# Altium schematic sheet ADP526X.SchDoc
size A3
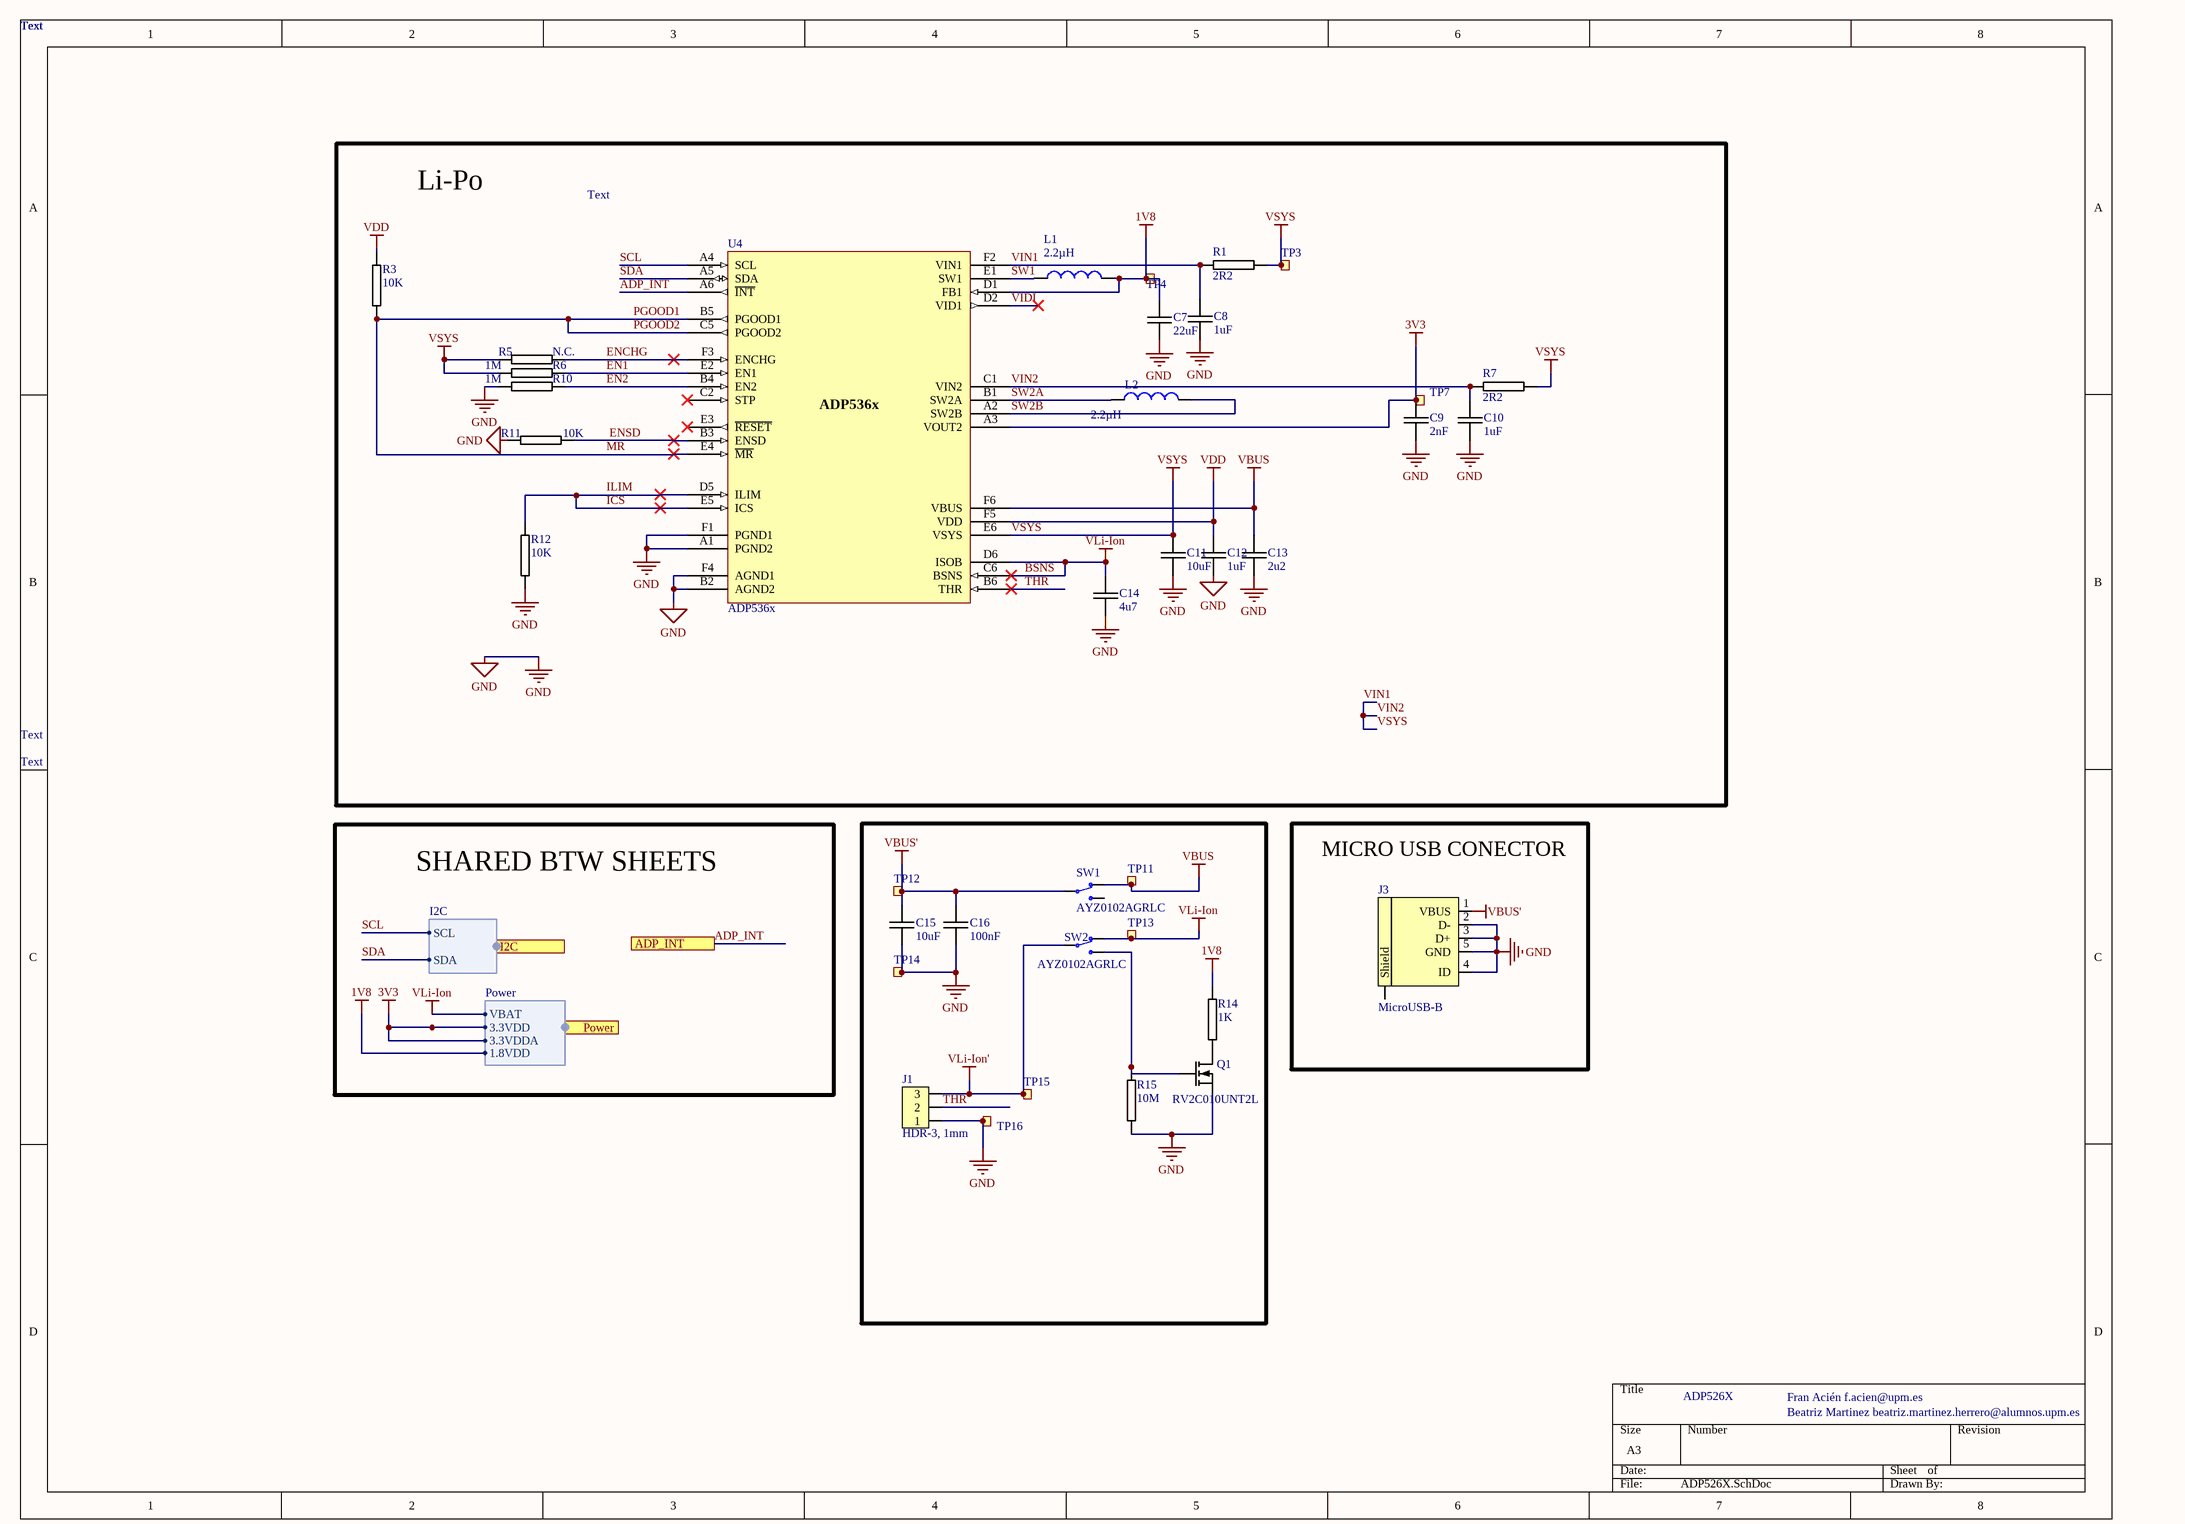
[diagram p0: ADP526X.SchDoc]

## Parts
C7  22uF  [0402C-TBD]
C8  1uF  [0402C-GENERIC]
C9  2nF  [0402C-TBD]
C10  1uF  [0402C-GENERIC]
C11  10uF  [0402C-GENERIC]
C12  1uF  [0402C-GENERIC]
C13  2u2  [0402C-GENERIC]
C14  4u7  [0402C-GENERIC]
C15  10uF  [0603C-GENERIC]
C16  100nF  [0603C-GENERIC]
J1  HDR-3, 1mm  [SM03B-SRSS-TB]
J3  MicroUSB-B  [USB-Micro-B-RA-SMD-PiP]
L1  2.2µH  [INDC2016X18N]
L2  2.2µH  [INDC2016X18N]
Q1  RV2C010UNT2L  [DFN65P100X40-3L]
R1  2R2  [0603R-GENERIC]
R3  10K  [0603R-10K]
R5  N.C.  [0603R-GENERIC]
R6  1M  [0603R-GENERIC]
R7  2R2  [0603R-GENERIC]
R10  1M  [0603R-GENERIC]
R11  10K  [0603R-10K]
R12  10K  [0603R-10K]
R14  1K  [0603R-1k]
R15  10M  [0603R-GENERIC]
SW1  AYZ0102AGRLC  [AYZ0102AGRLC]
SW2  AYZ0102AGRLC  [AYZ0102AGRLC]
TP3  Ø1.0mm,SMD  [TP_SMD_Ø1.0mm]  (value not drawn)  (no BOM)
TP4  Ø1.0mm,SMD  [TP_SMD_Ø1.0mm]  (value not drawn)  (no BOM)
TP7  Ø1.0mm,SMD  [TP_SMD_Ø1.0mm]  (value not drawn)  (no BOM)
TP11  Ø1.0mm,SMD  [TP_SMD_Ø1.0mm]  (value not drawn)  (no BOM)
TP12  Ø1.0mm,SMD  [TP_SMD_Ø1.0mm]  (value not drawn)  (no BOM)
TP13  Ø1.0mm,SMD  [TP_SMD_Ø1.0mm]  (value not drawn)  (no BOM)
TP14  Ø1.0mm,SMD  [TP_SMD_Ø1.0mm]  (value not drawn)  (no BOM)
TP15  Ø1.0mm,SMD  [TP_SMD_Ø1.0mm]  (value not drawn)  (no BOM)
TP16  Ø1.0mm,SMD  [TP_SMD_Ø1.0mm]  (value not drawn)  (no BOM)
U4  ADP536x  [BGA32C40P6X6_238X238X56]

## Blocks framed on the sheet
Li-Po: C7-C14 L1 L2 R1 R3 R5-R7 R10-R12 TP3 TP4 TP7 U4
MICRO USB CONECTOR: J3

## Ports
ADP_INT, I2C (harness I2C), Power (harness Power)

## Harnesses
I2C: SCL, SDA
Power: VBAT, 3.3VDD, 3.3VDDA, 1.8VDD

## Nets
1V8: C7.1 L1.2 R14.1 TP4.1 U4.D1(FB1) ; port Power.1.8VDD
3V3: C9.1 TP7.1 U4.A3(VOUT2) ; port Power.3.3VDD, port Power.3.3VDDA
BSNS: C14.1 SW2.1(N.C) TP13.1 U4.C6(BSNS) U4.D6(ISOB) ; port Power.VBAT  [also labelled VLi-Ion]
GND: C7.2 C8.2 C9.2 C10.2 C11.2 C12.2 C13.2 C14.2 C15.2 C16.2 J1.1 J3.2(D-) J3.3(D+) J3.4(ID) J3.5(GND) Q1.2(S) R10.1 R11.2 R12.2 R15.2 TP14.1 TP16.1 U4.A1(PGND2) U4.B2(AGND2) U4.F1(PGND1) U4.F4(AGND1)
VBUS: C13.1 SW1.1(N.C) TP11.1 U4.F6(VBUS)
VBUS': C15.1 C16.1 J3.1(VBUS) SW1.2(COM) TP12.1
VDD: C12.1 R3.2 U4.F5(VDD)
VIN1: C8.1 C10.1 C11.1 R1.1 R1.2 R5.1 R6.1 R7.1 R7.2 TP3.1 U4.C1(VIN2) U4.E6(VSYS) U4.F2(VIN1)  [also labelled VIN2, VSYS]
VLi-Ion': J1.3 SW2.2(COM) TP15.1
ADP_INT: U4.A6(~{INT}) ; port ADP_INT
EN1: R6.2 U4.E2(EN1)
EN2: R10.2 U4.B4(EN2)
ENCHG: R5.2 U4.F3(ENCHG)
ENSD: R11.1 U4.B3(ENSD)
ICS: R12.1 U4.D5(ILIM) U4.E5(ICS)
PGOOD1: R3.1 U4.B5(PGOOD1) U4.C5(PGOOD2) U4.E4(~{MR})  [also labelled PGOOD2]
SCL: U4.A4(SCL) ; port I2C.SCL
SDA: U4.A5(SDA) ; port I2C.SDA
SW1: L1.1 U4.E1(SW1)
SW2A: L2.1 U4.B1(SW2A)
SW2B: L2.2 U4.A2(SW2B)
THR: J1.2 U4.B6(THR)
VIDI: U4.D2(VID1)
NetQ1_1: Q1.1(G) R15.1 SW2.3(N.O)
NetQ1_3: Q1.3(D) R14.2

Not connected (* = marked no-connect by the designer): J3 6(Shield); SW1 3(N.O); U4 C2(STP)* E3(~{RESET})*

## Notes on the sheet
- Text
- SHARED BTW SHEETS
- ADP526X
- Fran Acién f.acien@upm.es
- Beatriz Martinez beatriz.martinez.herrero@alumnos.upm.es
- Labels drawn without touching a wire or pin: ILIM, MR

## Library data of the parts
C7-C11 C14 = 0402C-10UF-4V-X5R-SAM: CAPACITOR 0402 CERAMIC; Reel: C47
C12 = 0402C-1UF-25V-X5R-SAM: CAPACITOR 0402 CERAMIC; Reel: C49
C13 = 0402C-2U2-10V-X5R-SAM: CAPACITOR 0402 CERAMIC; Reel: C16
C15 = 0603C-10UF-10V-X5R-TDK: CAPACITOR 0603 CERAMIC; Manufacturer Part Number: C1608X5R0J106M; Manufacturer: TDK Corporation; Reel: C31; Supplier 1: Digi-Key; Supplier Part Number 1: 445-4112-2-ND
C16 = 0603C-100NF-25V-X7R-TDK: CAPACITOR 0603 CERAMIC; Manufacturer Part Number: C1608X7R1E104K; Manufacturer: TDK Corporation; Reel: C12; Supplier 1: Digi-Key; Supplier Part Number 1: 445-1316-2-ND
J1 = SM03B-SRSS-TB: 1.0mm pitch connector side entry SMD; Manufacturer: JST; Manufacturer Part Number: SM03B-SRSS-TB(LF)(SN); Part number IPS: 00000001785; Note: JST, Header; Artikkelnr Noca: N.A.; Part Number: SM03B-SRSS-TB; Footprint Doc: SM03B-SRSS-TB; LatestRevisionDate: 2017-10-09; Pin Count: 3; Publisher: Nordic Semiconductor; Published: 2017-10-09; Value: HDR-3, 1mm; ComponentLink1URL: *; ComponentLink1Description: Datasheet; ComponentLink2URL: *; ComponentLink2Description: Supplier link; HelpURL: http://www.jst-mfg.com/product/pdf/eng/eSH.pdf; Supplier 1: Digi-Key; Supplier Part Number 1: 455-1803-1-ND; Supplier 2: *; Supplier Part Number 2: *
J3 = MiniUSB-AB-SMT: MicroUSB-B-SMT; Manufacturer: Allen Creations Corp.; Manufacturer Part Number: AJU55-BS2111-L; Part number IPS: 00000007790; Artikkelnr Noca: 55029020; Part Number: USB-Micro-B-RA-SMD-PiP; Footprint Doc: USB-Micro-B-RA-SMD-PiP; LatestRevisionDate: 2016-04-21; Pin Count: 5; Publisher: Nordic Semiconductor; Published: 2014-10-07; Value: MicroUSB-B; Note: *; ComponentLink1URL: *; ComponentLink1Description: Datasheet; ComponentLink2URL: *; ComponentLink2Description: Supplier link; HelpURL: \\hizz\pro\app9717\Datasheet\connectores\Allen Creations Corp\AJU-211.pdf; Supplier 1: Cabcon; Supplier Part Number 1: AJU55-BS2111-L; Supplier 2: Digi-Key; Supplier Part Number 2: 609-4616-1-ND
L1 L2 = LQM2MPN4R7NG0L: Inductor Power Chip Shielded Multi-Layer 4.7uH 30% 1MHz Ferrite 1.1A 175mOhm DCR 0806 T/R; Package: None; Price: None; Value: *; MP: LQM2MPN4R7NG0L; Availability: Unavailable
Q1 = RV2C010UNT2L: N-Channel MOSFET, 20V, 1A, 470mOhm, 400mW; Manufacturer: Rohm Semiconductor; Part number IPS: N.A.; Artikkelnr Noca: 35010020; Part Number: RV2C010UNT2L; Manufacturer Part Number: RV2C010UNT2L; Footprint Doc: DFN-3; LatestRevisionDate: 2016-08-09; Publisher: Nordic Semiconductor; Published: 2016-08-09; Value: RV2C010UNT2L; Note: *; ComponentLink1URL: *; ComponentLink1Description: Datasheet; ComponentLink2URL: *; ComponentLink2Description: Supplier link; HelpURL: http://rohmfs.rohm.com/en/products/databook/datasheet/discrete/transistor/mosfet/rv2c010unt2l-e.pdf; Pin Count: 3; Supplier 1: Digi-Key; Supplier Part Number 1: RV2C010UNT2LCT-ND; Supplier 2: Mouser; Supplier Part Number 2: 755-RV2C010UNT2L
R1 R7 = 0603R-000: 2R2 Resistor
R3 R11 R12 = 0603R-10K: GENERIC RESISTOR 0603; Manufacturer: Stackpole Electronics Inc; Manufacturer Part Number: RMCF 1/16 10K 1% R; Tolerance: ±1%; Power (Watts): 0.1W, 1/10W; Temperature Coefficient: ±100ppm/°C; Resistance In Ohms: 10.0K; Reel: R21; Category: Resistors; Supplier Part Number: RMCF1/1610KFRDKR-ND; Lead Style: Surface Mount (SMD - SMT); RoHS: RoHS Compliant; Packaging: Digi-Reel®; Case: 0603 (1608 metric); Composition: Thick Film; Supplier: Digi-Key; Supplier 1: Digi-Key; Supplier Part Number 1: RMCF0603FT10K0DKR-ND
R5 = 0603R-000
R6 R10 = 0603R-1M: GENERIC RESISTOR 0603; Manufacturer: Stackpole Electronics Inc; Manufacturer Part Number: RMCF 1/16 1M 1% R; Power (Watts): 0.1W, 1/10W; Temperature Coefficient: ±100ppm/°C; Resistance In Ohms: 1.00M; Tolerance: ±1%; REEL: R51; Supplier: Digi-Key; Supplier Part Number: RMCF1/161MFRTR-ND; Category: Resistors; Lead Style: Surface Mount (SMD - SMT); Case: 0603 (1608 metric); RoHS: RoHS Compliant; Composition: Thick Film; Packaging: Tape & Reel (TR); Supplier 1: Digi-Key; Supplier Part Number 1: RMCF0603FT1M00TR-ND
R14 = 0603R-1K: GENERIC RESISTOR 0603; Manufacturer Part Number: RMCF 1/16 1K 1% R; Manufacturer: Stackpole Electronics Inc; Reel: R14; Supplier 1: Digi-Key; Supplier Part Number 1: RMCF0603FT1K00TR-ND
R15 = 0603R-10M: GENERIC RESISTOR 0603; Manufacturer Part Number: RMCF 1/16 10M 5% R; Manufacturer: Stackpole Electronics Inc; Reel: R15; Tolerance: ±5%; Temperature Coefficient: ±350ppm/°C; Power (Watts): 0.1W, 1/10W; Resistance In Ohms: 10.0M; Packaging: Tape & Reel (TR); Lead Style: Surface Mount (SMD - SMT); Case: 0603 (1608 metric); Features: -; Composition: Thick Film; RoHS: RoHS Compliant; Supplier: Digi-Key; Supplier Part Number: RMCF1/1610MJRTR-ND; Category: Resistors; Supplier 1: Digi-Key; Supplier Part Number 1: RMCF0603FT10M0DKR-ND
SW1 SW2 = AYZ0102AGRLC: Miniature slide switch, SPDT, Right-Angle, ON-ON, 12V, 100mA; Manufacturer: C&K; Artikkelnr Noca: N.A.; Part Number: AYZ0102AGRLC; Manufacturer Part Number: AYZ0102AGRLC; ComponentLink1URL: https://www.ckswitches.com/media/1431/ayz.pdf; ComponentLink1Description: Datasheet; ComponentLink2URL: *; ComponentLink2Description: Supplier link; Footprint Doc: AYZ0102AGRLC; LatestRevisionDate: 2019-05-08; Pin Count: 3; Publisher: Nordic Semiconductor; Published: 2019-05-08; Value: AYZ0102AGRLC; Note: *; Part number IPS: N.A.; Supplier 1: Digi-Key; Supplier Part Number 1: 401-2012-1-ND; Supplier 2: *; Supplier Part Number 2: *; HelpURL: https://www.ckswitches.com/media/1431/ayz.pdf
TP3 TP4 TP7 TP11-TP16 = TP_SMD_Ø1.0MM: 1.0mm circular SMD testpad; Manufacturer: Nordic Semiconductor; Artikkelnr Noca: N.A.; Part Number: TP_SMD_Ø1.0MM; Manufacturer Part Number: *; ComponentLink1URL: *; ComponentLink1Description: Datasheet; ComponentLink2URL: *; ComponentLink2Description: Supplier link; HelpURL: *; Footprint Doc: TP_SMD_Ø1.0mm; LatestRevisionDate: 2013-06-11; Pin Count: 1; Publisher: Nordic Semiconductor; Published: 2013-06-11; Value: Ø1.0mm,SMD; Note: *; Supplier 1: *; Supplier Part Number 1: *; Supplier 2: *; Supplier Part Number 2: *; Part number IPS: N.A.
U4 = ADP536x: Advanced Battery Management PMIC With Ultralow Iq Buck and Buck-Boost; Manufacturer: Analog Devices; Part number IPS: 80000001823; Artikkelnr Noca: N.A.; Part Number: ADP536x; Manufacturer Part Number: ADP536x; ComponentLink1URL: *; ComponentLink1Description: Datasheet; ComponentLink2URL: *; ComponentLink2Description: Supplier link; HelpURL: *; Footprint Doc: WLCSP-32; LatestRevisionDate: 2019-03-25; Pin Count: 32; Publisher: Nordic Semiconductor; Published: 2019-03-25; Value: ADP536x; Note: *; Supplier 1: *; Supplier Part Number 1: *; Supplier 2: *; Supplier Part Number 2: *